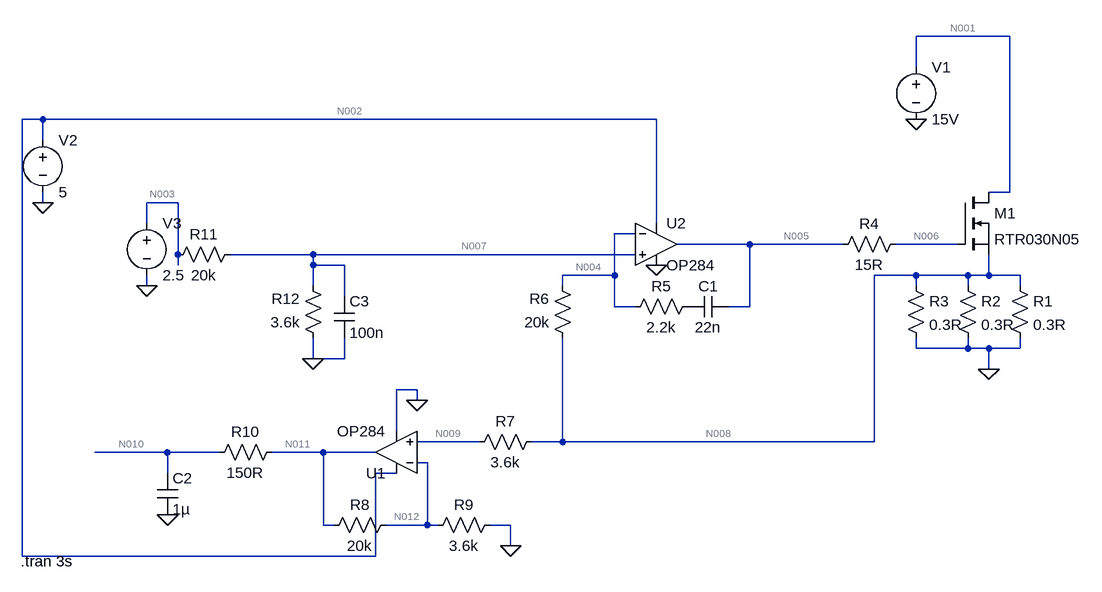
[diagram p0: schematic LoadSet_1.asc]
LoadSet_1.asc, the LTspice schematic file:
Version 4
SHEET 1 880 900
WIRE 288 -160 144 -160
WIRE 144 -112 144 -160
WIRE -1200 -32 -1232 -32
WIRE -256 -32 -1200 -32
WIRE -1200 0 -1200 -32
WIRE 288 80 288 -160
WIRE 288 80 256 80
WIRE -1200 96 -1200 80
WIRE -992 96 -1040 96
WIRE -1040 128 -1040 96
WIRE -256 128 -256 -32
WIRE -288 144 -320 144
WIRE -112 160 -224 160
WIRE 32 160 -112 160
WIRE 208 160 112 160
WIRE -992 176 -992 96
WIRE -784 176 -912 176
WIRE -288 176 -784 176
WIRE -992 192 -992 176
WIRE -784 192 -784 176
WIRE -736 192 -784 192
WIRE -320 208 -320 144
WIRE -320 208 -400 208
WIRE 144 208 80 208
WIRE 224 208 144 208
WIRE 256 208 256 176
WIRE 256 208 224 208
WIRE 304 208 256 208
WIRE -1040 224 -1040 208
WIRE -784 224 -784 192
WIRE -400 224 -400 208
WIRE 144 224 144 208
WIRE 224 224 224 208
WIRE 304 224 304 208
WIRE -736 240 -736 192
WIRE -320 256 -320 208
WIRE -288 256 -320 256
WIRE -112 256 -112 160
WIRE -112 256 -144 256
WIRE 144 320 144 304
WIRE 224 320 224 304
WIRE 224 320 144 320
WIRE 256 320 224 320
WIRE 304 320 304 304
WIRE 304 320 256 320
WIRE -784 336 -784 304
WIRE -736 336 -736 304
WIRE -736 336 -784 336
WIRE 256 352 256 320
WIRE -624 384 -656 384
WIRE -624 400 -624 384
WIRE -656 448 -656 384
WIRE -528 464 -624 464
WIRE -400 464 -400 304
WIRE -400 464 -448 464
WIRE 80 464 80 208
WIRE 80 464 -400 464
WIRE -1008 480 -1120 480
WIRE -928 480 -1008 480
WIRE -768 480 -848 480
WIRE -688 480 -768 480
WIRE -608 496 -624 496
WIRE -1008 512 -1008 480
WIRE -656 512 -688 512
WIRE -768 592 -768 480
WIRE -752 592 -768 592
WIRE -608 592 -608 496
WIRE -608 592 -672 592
WIRE -592 592 -608 592
WIRE -480 592 -512 592
WIRE -480 624 -480 592
WIRE -1232 640 -1232 -32
WIRE -688 640 -688 512
WIRE -688 640 -1232 640
FLAG 144 -32 0
FLAG 256 352 0
FLAG -480 624 0
FLAG -1008 576 0
FLAG -784 336 0
FLAG -1040 224 0
FLAG -1200 96 0
FLAG -256 192 0
FLAG -624 400 0
SYMBOL nmos 208 80 R0
SYMATTR InstName M1
SYMATTR Value RTR030N05
SYMBOL voltage 144 -128 R0
WINDOW 123 0 0 Left 0
WINDOW 39 0 0 Left 0
SYMATTR InstName V1
SYMATTR Value 15V
SYMBOL voltage -1200 -16 R0
WINDOW 123 0 0 Left 0
WINDOW 39 0 0 Left 0
SYMATTR InstName V2
SYMATTR Value 5
SYMBOL res 288 208 R0
SYMATTR InstName R1
SYMATTR Value 0.3R
SYMBOL res 208 208 R0
SYMATTR InstName R2
SYMATTR Value 0.3R
SYMBOL res 128 208 R0
SYMATTR InstName R3
SYMATTR Value 0.3R
SYMBOL res 128 144 R90
WINDOW 0 0 56 VBottom 2
WINDOW 3 32 56 VTop 2
SYMATTR InstName R4
SYMATTR Value 15R
SYMBOL res -192 240 R90
WINDOW 0 0 56 VBottom 2
WINDOW 3 32 56 VTop 2
SYMATTR InstName R5
SYMATTR Value 2.2k
SYMBOL res -384 320 R180
WINDOW 0 36 76 Left 2
WINDOW 3 36 40 Left 2
SYMATTR InstName R6
SYMATTR Value 20k
SYMBOL res -544 480 R270
WINDOW 0 32 56 VTop 2
WINDOW 3 0 56 VBottom 2
SYMATTR InstName R7
SYMATTR Value 3.6k
SYMBOL cap -144 240 R90
WINDOW 0 0 32 VBottom 2
WINDOW 3 32 32 VTop 2
SYMATTR InstName C1
SYMATTR Value 22n
SYMBOL res -656 576 R90
WINDOW 0 0 56 VBottom 2
WINDOW 3 32 56 VTop 2
SYMATTR InstName R8
SYMATTR Value 20k
SYMBOL res -608 608 R270
WINDOW 0 32 56 VTop 2
WINDOW 3 0 56 VBottom 2
SYMATTR InstName R9
SYMATTR Value 3.6k
SYMBOL res -832 464 R90
WINDOW 0 0 56 VBottom 2
WINDOW 3 32 56 VTop 2
SYMATTR InstName R10
SYMATTR Value 150R
SYMBOL cap -1024 512 R0
SYMATTR InstName C2
SYMATTR Value 1µ
SYMBOL res -896 160 R90
WINDOW 0 0 56 VBottom 2
WINDOW 3 32 56 VTop 2
SYMATTR InstName R11
SYMATTR Value 20k
SYMBOL res -768 320 R180
WINDOW 0 36 76 Left 2
WINDOW 3 36 40 Left 2
SYMATTR InstName R12
SYMATTR Value 3.6k
SYMBOL cap -752 240 R0
SYMATTR InstName C3
SYMATTR Value 100n
SYMBOL Opamps\\OP284 -256 96 R0
SYMATTR InstName U2
SYMBOL Opamps\\OP284 -656 544 R180
SYMATTR InstName U1
SYMBOL voltage -1040 112 R0
WINDOW 123 0 0 Left 0
WINDOW 39 0 0 Left 0
SYMATTR InstName V3
SYMATTR Value 2.5
TEXT -1234 648 Left 2 !.tran 3s

The netlist it stands for:
* LoadSet_1.asc
M1 N001 N006 N008 N008 RTR030N05
V1 N001 0 15V
V2 N002 0 5
R1 N008 0 0.3R
R2 N008 0 0.3R
R3 N008 0 0.3R
R4 N006 N005 15R
R5 P001 N004 2.2k
R6 N008 N004 20k
R7 N009 N008 3.6k
C1 N005 P001 22n
R8 N012 N011 20k
R9 N012 0 3.6k
R10 N011 N010 150R
C2 N010 0 1µ
R11 N007 N003 20k
R12 0 N007 3.6k
C3 N007 0 100n
XU2 N007 N004 N002 0 N005 OP284  ; pins In+ In- V+ V- OUT
XU1 N009 N012 N002 0 N011 OP284  ; pins In+ In- V+ V- OUT
V3 N003 0 2.5
.model NMOS NMOS
.model PMOS PMOS
.lib standard.mos
.tran 3s
.lib ADI1.lib
.backanno
.end

* Results of the author's LTspice run, read from the files saved beside the schematic
* Operating Point, zero values left out:
*   V(n001) = 15 V
*   V(n006) = 2.195 V
*   V(n008) = 376.7 mV
*   V(n002) = 5 V
*   V(n005) = 2.195 V
*   V(p001) = 382.3 mV
*   V(n004) = 382.3 mV
*   V(n009) = 377.7 mV
*   V(n012) = 377.7 mV
*   V(n011) = 2.471 V
*   V(n010) = 2.471 V
*   V(n007) = 382.2 mV
*   V(n003) = 2.5 V
*   Id(M1) = 3.767 A
*   Is(M1) = -3.767 A
*   I(R12) = -106.2 µA
*   I(R11) = -105.9 µA
*   I(R9) = 104.9 µA
*   I(R8) = -104.6 µA
*   I(R7) = 289.7 nA
*   I(R6) = -279.6 nA
*   I(R3) = 1.256 A
*   I(R2) = 1.256 A
*   I(R1) = 1.256 A
*   I(V3) = -105.9 µA
*   I(V2) = -2.01 mA
*   I(V1) = -3.767 A
*   Ix(u2:1) = -289.6 nA
*   Ix(u2:2) = -279.6 nA
*   Ix(u2:99) = 951.6 µA
*   Ix(u2:50) = -951.1 µA
*   Ix(u1:1) = -289.7 nA
*   Ix(u1:2) = -279.7 nA
*   Ix(u1:99) = 1.058 mA
*   Ix(u1:50) = -953 µA
*   Ix(u1:45) = -104.6 µA